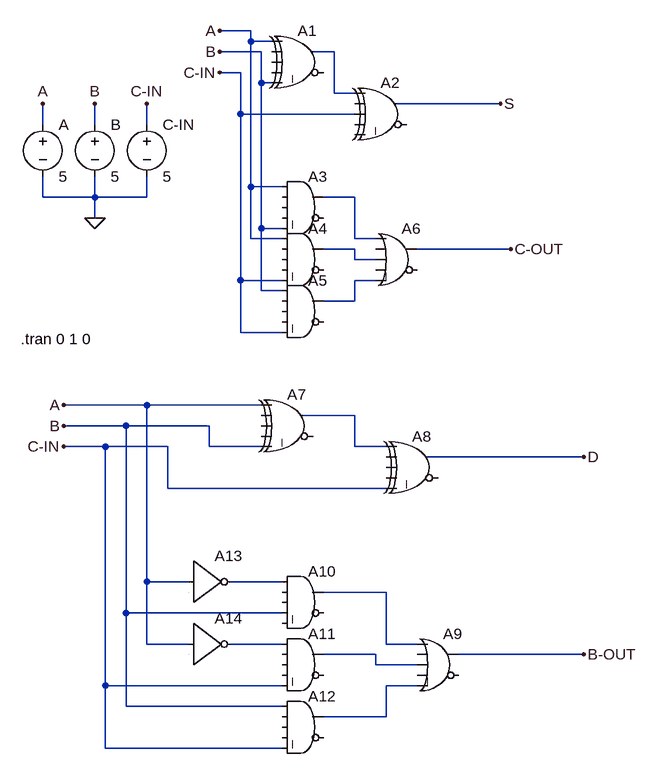
[diagram p0: schematic Full_Adder.asc]
Full_Adder.asc, the LTspice schematic file:
Version 4
SHEET 1 880 856
WIRE 112 -256 64 -256
WIRE 112 -240 112 -256
WIRE 144 -240 112 -240
WIRE 128 -224 64 -224
WIRE 240 -224 208 -224
WIRE 96 -192 64 -192
WIRE 128 -176 128 -224
WIRE 144 -176 128 -176
WIRE 240 -160 240 -224
WIRE 272 -160 240 -160
WIRE 496 -144 336 -144
WIRE 96 -128 96 -192
WIRE 272 -128 96 -128
WIRE -208 -112 -208 -144
WIRE -128 -112 -128 -144
WIRE -48 -112 -48 -144
WIRE 112 -16 112 -240
WIRE 160 -16 112 -16
WIRE -208 0 -208 -32
WIRE -128 0 -128 -32
WIRE -128 0 -208 0
WIRE -48 0 -48 -32
WIRE -48 0 -128 0
WIRE 272 0 224 0
WIRE -128 32 -128 0
WIRE 128 48 128 -176
WIRE 160 48 128 48
WIRE 112 64 112 -16
WIRE 160 64 112 64
WIRE 272 64 272 0
WIRE 304 64 272 64
WIRE 272 80 224 80
WIRE 512 80 368 80
WIRE 272 96 272 80
WIRE 304 96 272 96
WIRE 96 128 96 -128
WIRE 160 128 96 128
WIRE 304 128 272 128
WIRE 128 144 128 48
WIRE 160 144 128 144
WIRE 272 160 272 128
WIRE 272 160 224 160
WIRE 96 208 96 128
WIRE 160 208 96 208
WIRE -48 320 -176 320
WIRE 128 320 -48 320
WIRE 272 336 192 336
WIRE -80 352 -176 352
WIRE 48 352 -80 352
WIRE -112 384 -176 384
WIRE -16 384 -112 384
WIRE 48 384 48 352
WIRE 128 384 48 384
WIRE 272 384 272 336
WIRE 320 384 272 384
WIRE 624 400 384 400
WIRE -16 448 -16 384
WIRE 320 448 -16 448
WIRE -48 592 -48 320
WIRE 16 592 -48 592
WIRE 160 592 80 592
WIRE 320 608 224 608
WIRE -80 640 -80 352
WIRE 160 640 -80 640
WIRE -48 688 -48 592
WIRE 16 688 -48 688
WIRE 160 688 80 688
WIRE 320 688 320 608
WIRE 368 688 320 688
WIRE 304 704 224 704
WIRE 624 704 432 704
WIRE 304 720 304 704
WIRE 368 720 304 720
WIRE -112 752 -112 384
WIRE 160 752 -112 752
WIRE 368 752 320 752
WIRE -80 784 -80 640
WIRE 160 784 -80 784
WIRE 320 800 320 752
WIRE 320 800 224 800
WIRE -112 848 -112 752
WIRE 160 848 -112 848
FLAG -128 32 0
FLAG -208 -144 A
FLAG -128 -144 B
FLAG -48 -144 C-IN
FLAG 64 -256 A
FLAG 64 -224 B
FLAG 64 -192 C-IN
FLAG 496 -144 S
FLAG 512 80 C-OUT
FLAG 624 400 D
FLAG 624 704 B-OUT
FLAG -176 320 A
FLAG -176 352 B
FLAG -176 384 C-IN
SYMBOL Digital\\xor 192 -272 R0
SYMATTR InstName A1
SYMBOL Digital\\xor 320 -192 R0
SYMATTR InstName A2
SYMBOL Digital\\and 192 -48 R0
SYMATTR InstName A3
SYMBOL Digital\\and 192 32 R0
SYMATTR InstName A4
SYMBOL Digital\\and 192 112 R0
SYMATTR InstName A5
SYMBOL Digital\\or 336 32 R0
SYMATTR InstName A6
SYMBOL voltage -208 -128 R0
WINDOW 123 0 0 Left 0
WINDOW 39 0 0 Left 0
SYMATTR InstName A
SYMATTR Value 5
SYMBOL voltage -128 -128 R0
WINDOW 123 0 0 Left 0
WINDOW 39 0 0 Left 0
SYMATTR InstName B
SYMATTR Value 5
SYMBOL voltage -48 -128 R0
WINDOW 123 0 0 Left 0
WINDOW 39 0 0 Left 0
SYMATTR InstName C-IN
SYMATTR Value 5
SYMBOL Digital\\xor 176 288 R0
SYMATTR InstName A7
SYMBOL Digital\\xor 368 352 R0
SYMATTR InstName A8
SYMBOL Digital\\or 400 656 R0
SYMATTR InstName A9
SYMBOL Digital\\and 192 560 R0
SYMATTR InstName A10
SYMBOL Digital\\and 192 656 R0
SYMATTR InstName A11
SYMBOL Digital\\and 192 752 R0
SYMATTR InstName A12
SYMBOL Digital\\inv 16 528 R0
SYMATTR InstName A13
SYMBOL Digital\\inv 16 624 R0
SYMATTR InstName A14
TEXT -242 218 Left 2 !.tran 0 1 0

The netlist it stands for:
* Full_Adder.asc
A1 A 0 0 0 B 0 N001 0 XOR
A2 N001 0 C-IN 0 0 0 S 0 XOR
A3 A 0 0 0 B 0 N002 0 AND
A4 A 0 0 0 C-IN 0 N003 0 AND
A5 B 0 0 0 C-IN 0 N004 0 AND
A6 N002 0 N003 0 N004 0 C-OUT 0 OR
V§A A 0 5
V§B B 0 5
V§C-IN C-IN 0 5
A7 A 0 0 0 B 0 N005 0 XOR
A8 N005 0 0 0 C-IN 0 D 0 XOR
A9 N007 0 N009 0 N010 0 B-OUT 0 OR
A10 N006 0 0 B 0 0 N007 0 AND
A11 N008 0 0 0 C-IN 0 N009 0 AND
A12 B 0 0 0 C-IN 0 N010 0 AND
A13 A 0 0 0 0 N006 0 0 BUF
A14 A 0 0 0 0 N008 0 0 BUF
.tran 0 1 0
.backanno
.end